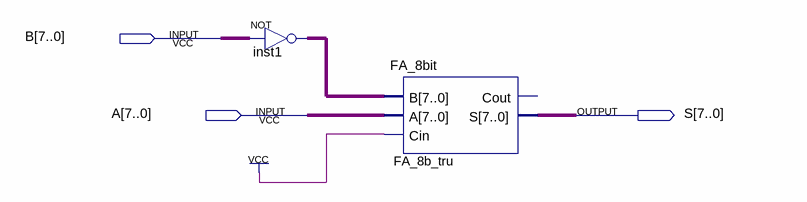
[diagram p0: schematic sheet]
// Quartus schematic BoTru_8bit.bdf as structural Verilog: 2 symbols, 3 pins
module BoTru_8bit (
  input  [7:0] B,
  input  [7:0] A,
  output [7:0] S
);

  wire [7:0] inst1_out;

  assign inst1_out = ~B;  // NOT inst1, 8 bits wide
  FA_8bit FA_8b_tru (.B(inst1_out), .A(A), .Cin(1'b1), .S(S));  // open: Cout
endmodule
